# Altium schematic sheet ultrasonic_imu_sensor.SchDoc
size A; SheetNumber: 6; SheetTotal: 8
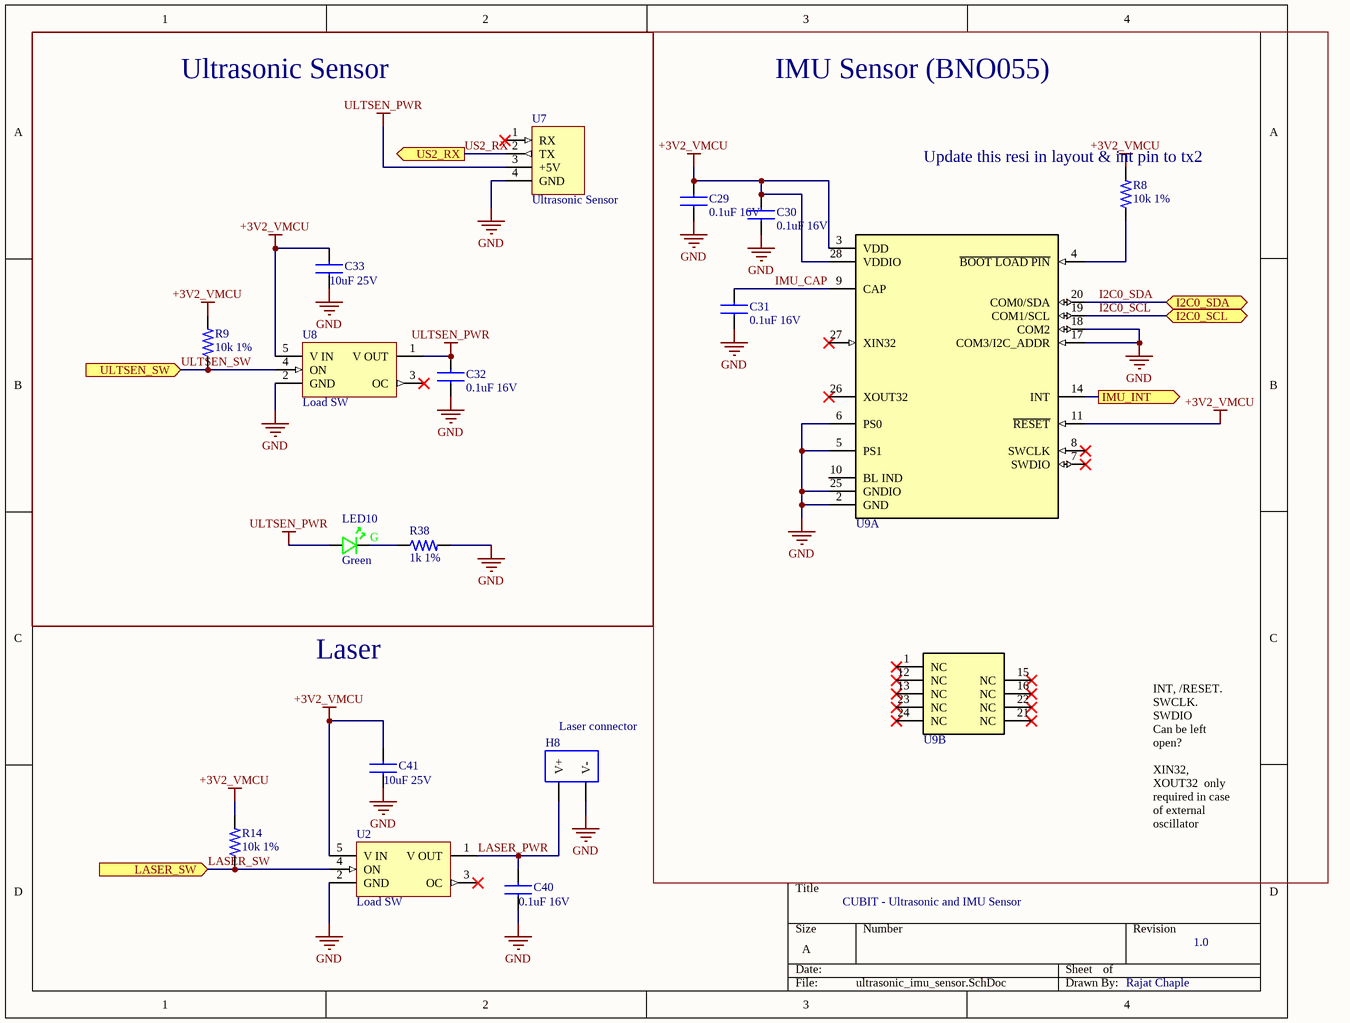
[diagram p0: ultrasonic_imu_sensor.SchDoc]

## Parts
C29  0.1uF 16V  [CAP_0603_1MM]
C30  0.1uF 16V  [CAP_0603_1MM]
C31  0.1uF 16V  [CAP_0603_1MM]
C32  0.1uF 16V  [CAP_0603_1MM]
C33  10uF 25V  [CAP_0805_02X125]
C40  0.1uF 16V  [CAP_0603_1MM]
C41  10uF 25V  [CAP_0805_02X125]
H8  Laser connector  [BAT_CONN]
LED10  Green  [LED_0603_RED_WL-SMCW]
R8  10k 1%  [2_Chip_0603_RMCF]
R9  10k 1%  [2_Chip_0603_RMCF]
R14  10k 1%  [2_Chip_0603_RMCF]
R38  1k 1%  [2_Chip_0603_RMCF]
U2  Load SW  [SOT65P210X110-5N]
U7  Ultrasonic Sensor  [4_PIN_ultrasonic_sensor]
U8  Load SW  [SOT65P210X110-5N]
U9  BNO005  [LGA28R50P4X10_380X520X100]  (value not drawn)  (parts A,B of 2)

## Blocks framed on the sheet
Ultrasonic Sensor: C32 C33 LED10 R9 R38 U7 U8
IMU Sensor (BNO055): C29-C31 R8 U9

## Ports
I2C0_SCL (bidir), I2C0_SDA (bidir), IMU_INT (out), LASER_SW (in), ULTSEN_SW (in), US2_RX (out)

## Nets
+3V2_VMCU: C29.1 C30.1 C33.1 C41.1 R8.2 R9.2 R14.2 U2.5(V_IN) U8.5(V_IN) U9.3(VDD) U9.11(~{RESET}) U9.28(VDDIO)
GND: C29.2 C30.2 C31.2 C32.2 C33.2 C40.2 C41.2 H8.V- R38.2 U2.2(GND) U7.4(GND) U8.2(GND) U9.2(GND) U9.5(PS1) U9.6(PS0) U9.17(COM3/I2C_ADDR) U9.18(COM2) U9.25(GNDIO)
ULTSEN_PWR: C32.1 LED10.A U7.3(+5V) U8.1(V_OUT)
I2C0_SCL: U9.19(COM1/SCL) ; port I2C0_SCL
I2C0_SDA: U9.20(COM0/SDA) ; port I2C0_SDA
IMU_CAP: C31.1 U9.9(CAP)
IMU_INT: U9.14(INT) ; port IMU_INT
LASER_PWR: C40.1 H8.V+ U2.1(V_OUT)
LASER_SW: R14.1 U2.4(ON) ; port LASER_SW
ULTSEN_SW: R9.1 U8.4(ON) ; port ULTSEN_SW
US2_RX: U7.2(TX) ; port US2_RX
NetLED10_C: LED10.C R38.1
NetR8_1: R8.1 U9.4(~{BOOT_LOAD_PIN})

Not connected (* = marked no-connect by the designer): U2 3(OC)*; U7 1(RX)*; U8 3(OC)*; U9 1(NC)* 7(SWDIO)* 8(SWCLK)* 10(BL_IND) 12(NC)* 13(NC)* 15(NC)* 16(NC)* 21(NC)* 22(NC)* 23(NC)* 24(NC)* 26(XOUT32)* 27(XIN32)*

## Notes on the sheet
- (near R8) Update this resi in layout & int pin to tx2
- Laser
- INT, /RESET. SWCLK. SWDIO
  Can be left open?
  XIN32, XOUT32  only required in case of external oscillator
- CUBIT - Ultrasonic and IMU Sensor
- 1.0
- Rajat Chaple
- (in symbol QBLP601-AG1) G

## Library data of the parts
C29-C32 C40 = C0805C104K4RACAUTO: Cap Ceramic 0.1uF 16V X7R 10% SMD 0603 125°C Paper T/R; Manufacturer: KEMET; Capacitance: 100nF; Supplier 1: Digi-Key; Manufacturer Part Number: C0805C104K4RACAUTO; RoHS: Yes; Category: Ceramic Capacitors; Stock 1: 15900; Pricing 1: 1=0.24000, 10=0.16200, 50=0.09700, 100=0.08190, 500=0.05606, 1000=0.04959 (USD); Case/Package: 0805; Min Operating Temperature: -55°C; Max Operating Temperature: 125°C; Tolerance: 10%; Packaging: Tape and Reel; Dielectric: X7R; Length: 2mm; Depth: 1.25mm; RoHS Compliant: Yes; ComponentLink1URL: http://components.arrow.com/part/dataview/0323_00325188?src-supplier=Arrow+Europe; ComponentLink1Description: http://components.arrow.com/part/dataview/0323_00325188?src-supplier=Arrow+Europe
C33 C41 = GRM21BR61E106KA73K: Cap 0805 25 V 10 uF ±20% Tolerance X5R Monolithic Ceramic Chip Capacitor; Manufacturer: Murata; Tolerance: 10%; Supplier 1: Digi-Key; Manufacturer Part Number: GRM21BR61E106KA73K; RoHS: Yes; Category: Ceramic Capacitors; Stock 1: 1875; Pricing 1: 1=0.23000, 10=0.15700, 50=0.09400, 100=0.07940, 500=0.05434, 1000=0.04807, 2500=0.04598, 5000=0.04180 (USD); Mount: Surface Mount; Case/Package: 0805; Weight: 0.000335oz; Min Operating Temperature: -55°C; Max Operating Temperature: 85°C; Packaging: Tape and Reel; Capacitance: 10uF; Voltage Rating: 25V; Package Quantity: 10000; Dielectric: X5R; Voltage Rating (DC): 25V; Length: 0.079inch; Width: 0.049inch; Thickness: 0.055inch; RoHS Compliant: Yes; ComponentLink1URL: http://www.mouser.com/ds/2/281/c02e-2905.pdf?src-supplier=Mouser; ComponentLink1Description: http://www.mouser.com/ds/2/281/c02e-2905.pdf?src-supplier=Mouser; ComponentLink2URL: http://search.murata.co.jp/Ceramy/image/img/A01X/G101/ENG/GRM21BR61E106KA73-01.pdf?src-supplier=Digi-Key; ComponentLink2Description: http://search.murata.co.jp/Ceramy/image/img/A01X/G101/ENG/GRM21BR61E106KA73-01.pdf?src-supplier=Digi-Key; ComponentLink3URL: https://search.murata.co.jp/Ceramy/image/img/A01X/G101/ENG/GRM21BR61E106KA73-01.pdf?src-supplier=Digi-Key; ComponentLink3Description: https://search.murata.co.jp/Ceramy/image/img/A01X/G101/ENG/GRM21BR61E106KA73-01.pdf?src-supplier=Digi-Key
H8 = batt_conn_pad: 2.00mm Pitch
LED10 = QBLP601-AG1: Led Green Clear 0603 SMD; Manufacturer: QT-Brightek; Supplier 1: Digi-Key; Manufacturer Part Number: QBLP601-AG1; RoHS: No; Stock 1: 5990; Pricing 1: 1=0.35000, 10=0.19000, 100=0.08820, 500=0.08140, 1000=0.06377, 2000=0.06242 (USD)
R8 R9 R14 = RMCF0603FT10K0: Res 10K Ohm 1% 1/10W ±100ppm/°C Molded SMD SMD Paper T/R; Manufacturer: Stackpole Electronics; Resistance: 10kR; Power Rating: 100mW; Supplier 1: Digi-Key; Manufacturer Part Number: RMCF0603FT10K0; RoHS: Yes; Category: Chip SMD Resistors; Stock 1: 15114443; Pricing 1: 5000=0.00218 (USD); Mount: Surface Mount; Case/Package: 0603; Case Code (Metric): 1608; Case Code (Imperial): 0603; Contact Plating: Tin,Matte; Size Code: 0603; Min Operating Temperature: -55°C; Max Operating Temperature: 155°C; Tolerance: 1%; Packaging: Tape and Reel; Resistor Type: Thick Film; Number of Terminations: 2; Max Power Dissipation: 100mW; Temperature Coefficient: 100ppm/°C; Features: Automotive AEC-Q200; Series: RMCF; Construction: Rectangular; Length: 1.55mm; Width: 0.031inch; Height: 0.022inch; Depth: 0.8mm; Radiation Hardening: No; Military Standard: Not; Lead Free: Lead Free; RoHS Compliant: Yes; ComponentLink1URL: http://components.arrow.com/part/dataview/43747082S6756917N1174?src-supplier=Arrow+Electronics; ComponentLink1Description: http://components.arrow.com/part/dataview/43747082S6756917N1174?src-supplier=Arrow+Electronics; ComponentLink2URL: https://www.seielect.com/catalog/SEI-RMCF_RMCP.pdf?src-supplier=Avnet; ComponentLink2Description: https://www.seielect.com/catalog/SEI-RMCF_RMCP.pdf?src-supplier=Avnet; ComponentLink3URL: http://www.seielect.com/catalog/sei-rmc.pdf?src-supplier=Future+Electronics; ComponentLink3Description: http://www.seielect.com/catalog/sei-rmc.pdf?src-supplier=Future+Electronics; ComponentLink4URL: https://www.verical.com/server-webapp/html/getDatasheet?partID=360913&src-supplier=Verical; ComponentLink4Description: https://www.verical.com/server-webapp/html/getDatasheet?partID=360913&src-supplier=Verical; ComponentLink5URL: https://www.seielect.com/catalog/sei-rmcf_rmcp.pdf?src-supplier=Digi-Key; ComponentLink5Description: https://www.seielect.com/catalog/sei-rmcf_rmcp.pdf?src-supplier=Digi-Key
R38 = RMCF0603FT1K00: Res 1K Ohm 1% 0.1W(1/10W) ±100ppm/C Pad SMD Automotive T/R; Manufacturer: Stackpole Electronics; Resistance: 1kR; Power Rating: 100mW; Temperature Coefficient: 100ppm/°C; Supplier 1: Digi-Key; Manufacturer Part Number: RMCF0603FT1K00; RoHS: Yes; Category: Chip SMD Resistors; Pricing 1: 1=0.10000, 10=0.01700, 100=0.00680, 1000=0.00305, 2500=0.00264 (USD); Mount: Surface Mount; Case/Package: 0603; Case Code (Metric): 1608; Case Code (Imperial): 0603; Contact Plating: Tin,Matte; Size Code: 0603; Min Operating Temperature: -55°C; Max Operating Temperature: 155°C; Tolerance: 1%; Packaging: Tape and Reel; Resistor Type: Thick Film; Number of Terminations: 2; Max Power Dissipation: 100mW; Features: Automotive AEC-Q200; Series: RMCF; Construction: Rectangular; Length: 1.55mm; Width: 0.031inch; Height: 0.022inch; Depth: 0.8mm; Radiation Hardening: No; Military Standard: Not; Lead Free: Lead Free; RoHS Compliant: Yes; ComponentLink1URL: https://www.seielect.com/catalog/sei-rmcf_rmcp.pdf?src-supplier=Digi-Key; ComponentLink1Description: https://www.seielect.com/catalog/sei-rmcf_rmcp.pdf?src-supplier=Digi-Key; ComponentLink2URL: https://www.seielect.com/catalog/SEI-RMCF_RMCP.pdf?src-supplier=Avnet; ComponentLink2Description: https://www.seielect.com/catalog/SEI-RMCF_RMCP.pdf?src-supplier=Avnet; ComponentLink3URL: https://www.seielect.com/catalog/SEI-Packaging.pdf?src-supplier=Avnet; ComponentLink3Description: https://www.seielect.com/catalog/SEI-Packaging.pdf?src-supplier=Avnet; ComponentLink4URL: https://www.seielect.com/catalog/SEI-Packaging.pdf?src-supplier=Arrow+Electronics; ComponentLink4Description: https://www.seielect.com/catalog/SEI-Packaging.pdf?src-supplier=Arrow+Electronics; ComponentLink5URL: https://www.seielect.com/catalog/SEI-RMCF_RMCP.pdf?src-supplier=Avnet+Asia; ComponentLink5Description: https://www.seielect.com/catalog/SEI-RMCF_RMCP.pdf?src-supplier=Avnet+Asia; ComponentLink6URL: http://www.seielect.com/Catalog/SEI-rmc.pdf?src-supplier=Future+Electronics; ComponentLink6Description: http://www.seielect.com/Catalog/SEI-rmc.pdf?src-supplier=Future+Electronics; ComponentLink7URL: https://www.seielect.com/catalog/SEI-Packaging.pdf?src-supplier=Verical; ComponentLink7Description: https://www.seielect.com/catalog/SEI-Packaging.pdf?src-supplier=Verical; ComponentLink8URL: https://www.seielect.com/catalog/SEI-Packaging.pdf?src-supplier=Quest; ComponentLink8Description: https://www.seielect.com/catalog/SEI-Packaging.pdf?src-supplier=Quest
U2 U8 = TPS22942DCKR: 5.5-V, 0.1-A, 500-mΩ, load switch with current limit and active low enable 5-SC70 -40 to 85; Manufacturer: Texas Instruments; Number of Outputs: 1; Output Current: 200mA; Nominal Supply Current: 1uA; Max Output Current: 100mA; Max Supply Voltage: 5.5V; Min Supply Voltage: 1.62V; Interface: On/Off; On-State Resistance: 500mR; Turn-On Delay Time: 60us; Turn-Off Delay Time: 30us; Max Supply Current: 80uA; Max Power Dissipation: 1.22mW; Quiescent Current: 40uA; Fault Protection: Over Temperature; Output Configuration: High Side; Supplier 1: Digi-Key; Manufacturer Part Number: TPS22942DCKR; RoHS: Yes; Category: Hot Swap Controllers; Stock 1: 1111; Pricing 1: 1=1.24000, 10=1.10700, 25=1.05080, 100=0.86310, 250=0.80676, 500=0.71296, 1000=0.61950 (USD); Case/Package: SC; Number of Pins: 5; Weight: 8.8E-05oz; Min Operating Temperature: -40°C; Max Operating Temperature: 85°C; Packaging: Tape and Reel; Number of Inputs: 1; Package Quantity: 3000; Max Input Voltage: 5.5V; Min Input Voltage: 1.62V; Termination: SMD/SMT; Min Current Limit: 100mA; Number of Channels: 1; Radiation Hardening: No; REACH SVHC: No SVHC; Lead Free: Lead Free; RoHS Compliant: Yes; ComponentLink1URL: https://datasheet.ciiva.com/1962/tps22945-1962436.pdf?src-supplier=Digi-Key; ComponentLink1Description: https://datasheet.ciiva.com/1962/tps22945-1962436.pdf?src-supplier=Digi-Key; ComponentLink2URL: https://datasheet.ciiva.com/15103/getdatasheetpartid-122296-15103873.pdf?src-supplier=Verical; ComponentLink2Description: https://datasheet.ciiva.com/15103/getdatasheetpartid-122296-15103873.pdf?src-supplier=Verical; ComponentLink3URL: https://datasheet.ciiva.com/1512/1840307-1512708.pdf?src-supplier=Element14; ComponentLink3Description: https://datasheet.ciiva.com/1512/1840307-1512708.pdf?src-supplier=Element14; ComponentLink4URL: https://datasheet.ciiva.com/1963/tps22942-1963503.pdf?src-supplier=Digi-Key; ComponentLink4Description: https://datasheet.ciiva.com/1963/tps22942-1963503.pdf?src-supplier=Digi-Key; ComponentLink5URL: https://datasheet.ciiva.com/1963/tps22942-1963502.pdf?src-supplier=Digi-Key; ComponentLink5Description: https://datasheet.ciiva.com/1963/tps22942-1963502.pdf?src-supplier=Digi-Key; ComponentLink6URL: https://datasheet.ciiva.com/3233/tps22945-3233582.pdf?src-supplier=Avnet; ComponentLink6Description: https://datasheet.ciiva.com/3233/tps22945-3233582.pdf?src-supplier=Avnet; ComponentLink7URL: https://datasheet.ciiva.com/26074/tps22945-26074375.pdf?src-supplier=Avnet+Europe; ComponentLink7Description: https://datasheet.ciiva.com/26074/tps22945-26074375.pdf?src-supplier=Avnet+Europe
U9 = BNO055